# EAGLE design relay node (EAGLE 9.6.2)
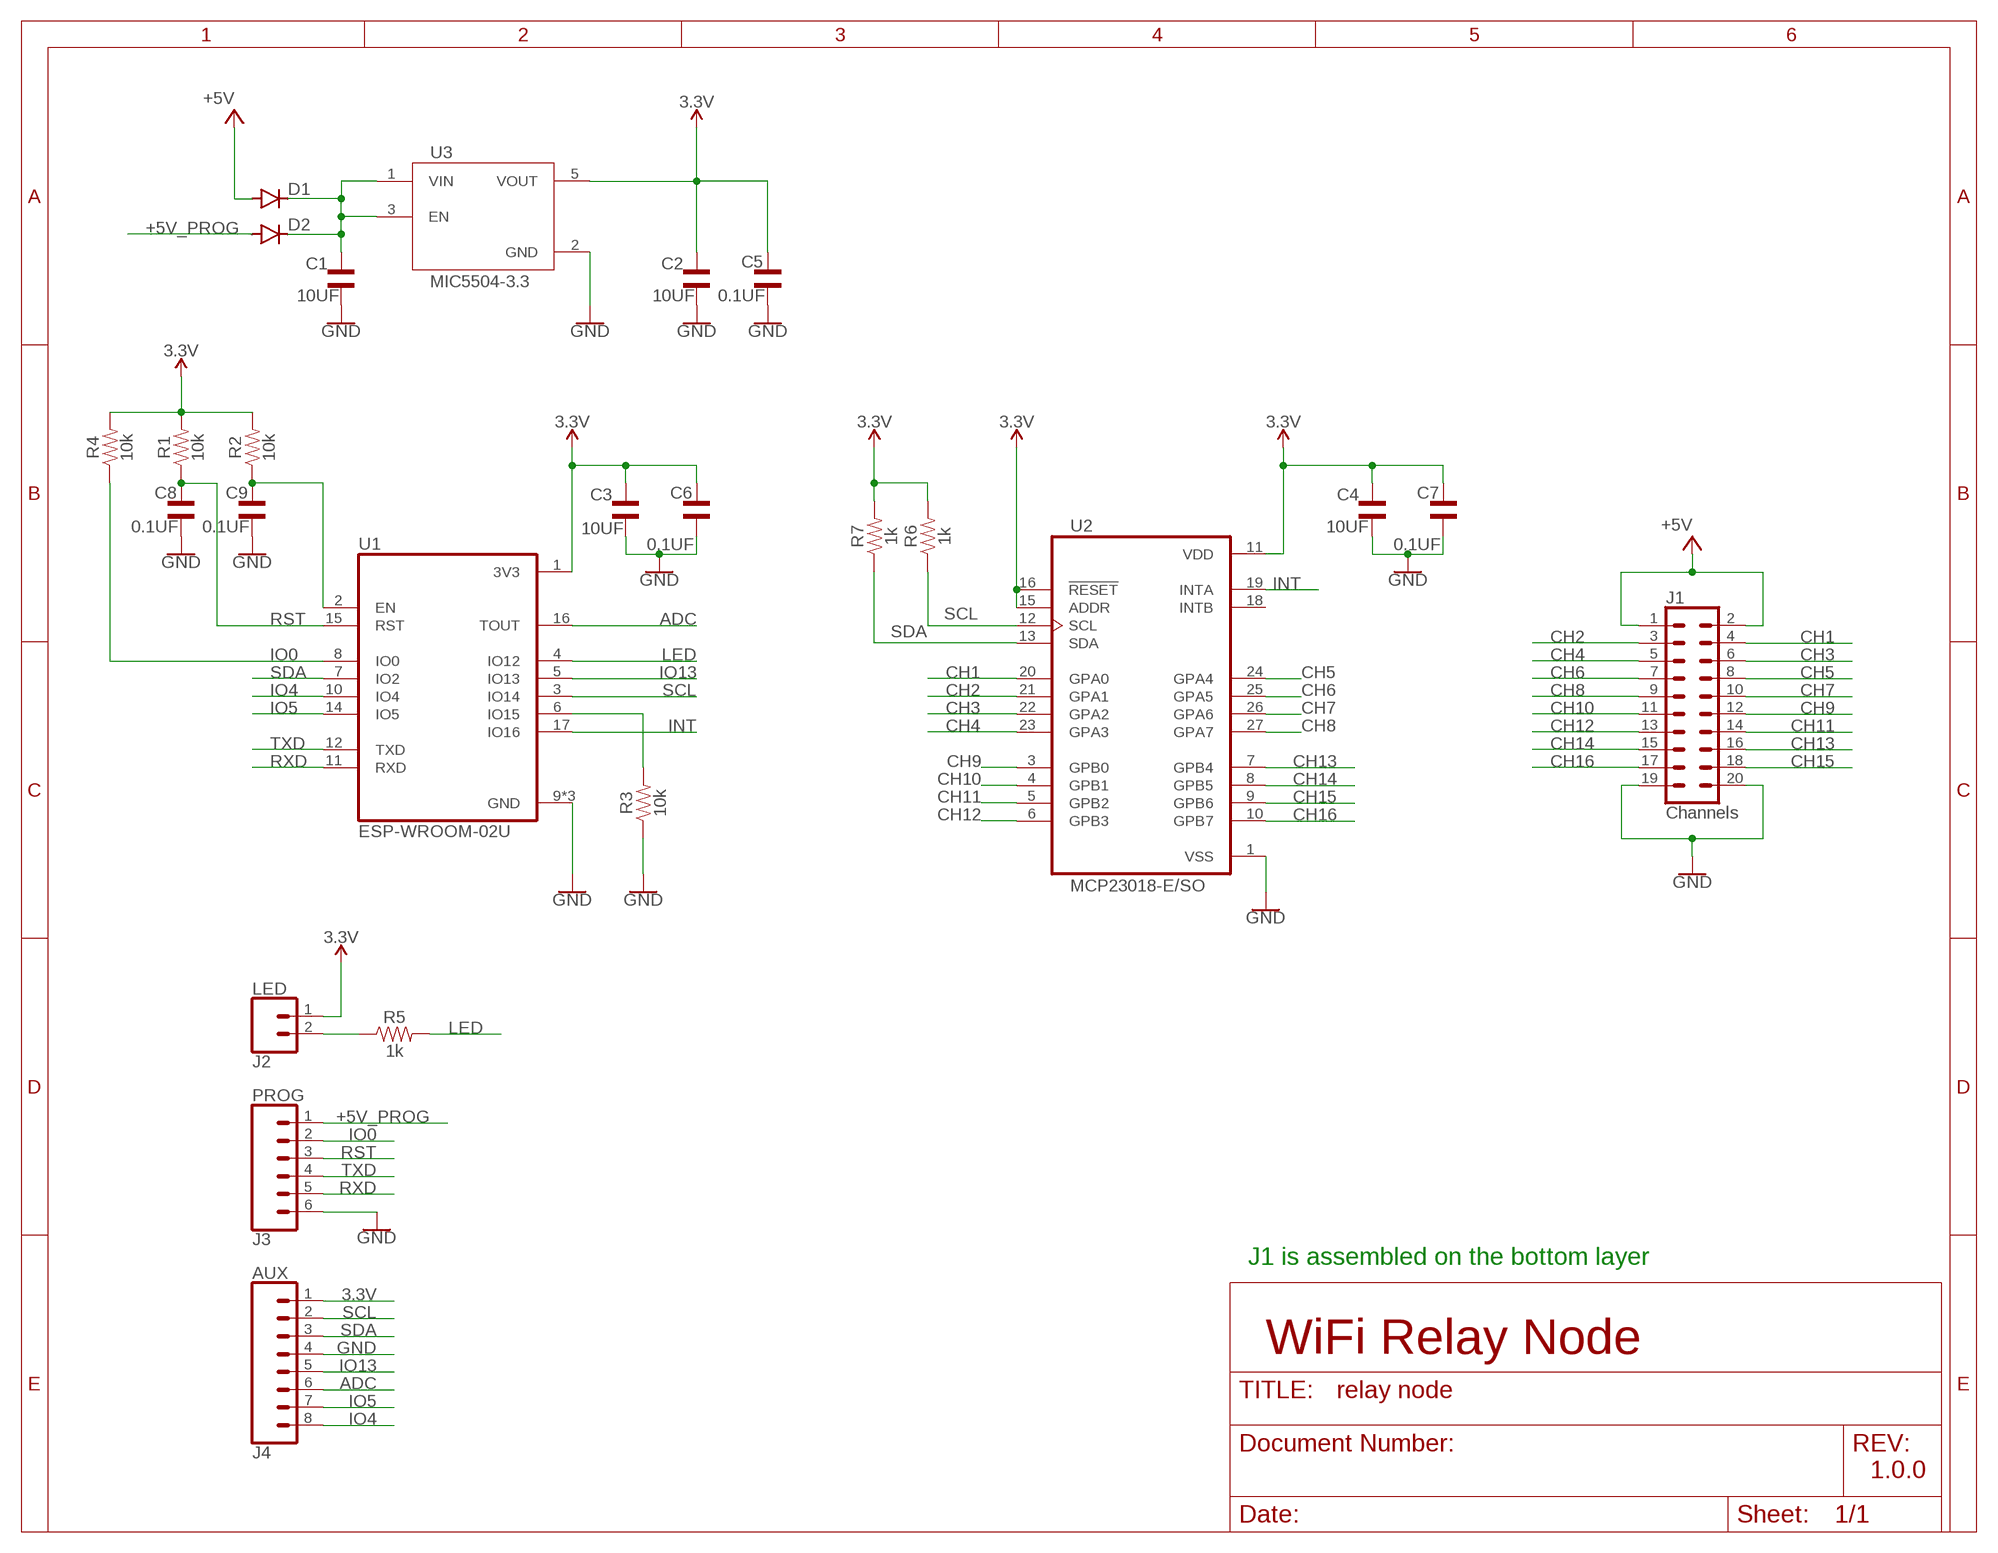
[diagram p0: schematic, sheet 1]

## Parts
C1  10UF  [CAPC2012X135N]
C2  10UF  [CAPC2012X135N]
C3  10UF  [CAPC2012X135N]
C4  10UF  [CAPC2012X135N]
C5  0.1UF  [CAPC1608X90]
C6  0.1UF  [CAPC1608X90]
C7  0.1UF  [CAPC1608X90]
C8  0.1UF  [CAPC1608X90]
C9  0.1UF  [CAPC1608X90]
D1  MBR0520LT  [SOD123]
D2  MBR0520LT  [SOD123]
J1  Channels  CONN_10X2NOSILK  [2X10_NOSILK]
J2  LED  CONN_02  [1X02]
J3  PROG  CONN_06SILK_FEMALE_PTH  [1X06]
J4  AUX  CONN_08"  [1X08]
R1  10k  10KOHM-0603-1/10W-5%  [0603]
R2  10k  10KOHM-0603-1/10W-5%  [0603]
R3  10k  10KOHM-0603-1/10W-5%  [0603]
R4  10k  10KOHM-0603-1/10W-5%  [0603]
R5  1k  1KOHM-0603-1/10W-5%  [0603]
R6  1k  1KOHM-0603-1/10W-5%  [0603]
R7  1k  1KOHM-0603-1/10W-5%  [0603]
U1  ESP-WROOM-02U  [MODULE_ESP-WROOM-02U]
U2  MCP23018-E/SO  [SOIC127P1030X265-28N]
U3  MIC5504-3.3  MIC5504-3.3YM5-T5  [SOT95P280X145-5N]

## Nets
3.3V: C2.1 C3.1 C4.1 C5.1 C6.1 C7.1 J2.1 J4.1 R1.2 R2.2 R4.2 R6.2 R7.2 U1.1(3V3) U2.11(VDD) U2.15(ADDR) U2.16(!RESET) U3.5(VOUT)
+5V: D1.A J1.1 J1.2
+5V_PROG: D2.A J3.1
ADC: J4.6 U1.16(TOUT)
CH1: J1.4 U2.20(GPA0)
CH2: J1.3 U2.21(GPA1)
CH3: J1.6 U2.22(GPA2)
CH4: J1.5 U2.23(GPA3)
CH5: J1.8 U2.24(GPA4)
CH6: J1.7 U2.25(GPA5)
CH7: J1.10 U2.26(GPA6)
CH8: J1.9 U2.27(GPA7)
CH9: J1.12 U2.3(GPB0)
CH10: J1.11 U2.4(GPB1)
CH11: J1.14 U2.5(GPB2)
CH12: J1.13 U2.6(GPB3)
CH13: J1.16 U2.7(GPB4)
CH14: J1.15 U2.8(GPB5)
CH15: J1.18 U2.9(GPB6)
CH16: J1.17 U2.10(GPB7)
GND: C1.2 C2.2 C3.2 C4.2 C5.2 C6.2 C7.2 C8.2 C9.2 J1.19 J1.20 J3.6 J4.4 R3.1 U1.9(GND) U1.13(GND) U1.18(GND) U2.1(VSS) U3.2(GND)
INT: U1.17(IO16) U2.19(INTA)
IO0: J3.2 R4.1 U1.8(IO0)
IO4: J4.8 U1.10(IO4)
IO5: J4.7 U1.14(IO5)
IO13: J4.5 U1.5(IO13)
LED: R5.2 U1.4(IO12)
N$1: C1.1 D1.C D2.C U3.1(VIN) U3.3(EN)
N$2: R3.2 U1.6(IO15)
N$3: C9.1 R2.1 U1.2(EN)
N$6: J2.2 R5.1
RST: C8.1 J3.3 R1.1 U1.15(RST)
RXD: J3.5 U1.11(RXD)
SCL: J4.2 R6.1 U1.3(IO14) U2.12(SCL)
SDA: J4.3 R7.1 U1.7(IO2) U2.13(SDA)
TXD: J3.4 U1.12(TXD)
Unconnected: U2.18(INTB)

## Notes on the sheet
- J1 is assembled on the bottom layer
- WiFi Relay Node
- 1.0.0

## Library data of the parts
C1-C4 = SFM-Project:10UF: CAP 10UF 25VDC Z6S 20% SMD 0805 EMBOSSED TAPE; DESCRIPTION: SMD Capacitor X6S(EIA) with Capacitance: 10uF Tol. 20%. Rated Voltage: 25Vdc; DIGI-KEY_PART_NUMBER: 490-10503-1-ND; DIGIKEY-PURCHASE-URL: https://snapeda.com/shop?store=DigiKey&id=1770901; MF: Murata; MP: GRM21BC81E106ME51L; PACKAGE: 0805 Murata
C5-C9 = SFM-Project:0.1UF: Cap Ceramic 0.1uF 25VDC Y5V -20% to 80% SMD 0603 Paper T/R; DESCRIPTION: 0.1µF -20%, +80% 25V Ceramic Capacitor Y5V (F) 0603 (1608 Metric); DIGI-KEY_PART_NUMBER: 399-1100-1-ND; MF: KEMET; MP: C0603C104Z3VACTU; PACKAGE: 0603 Kemet
D1 D2 = SFM-Project:MBR0520LT: SCHOTTKY BARRIER RECTIFIER Source: http://onsemi.com .. MBR0520LT1-D.pdf
J1 = SFM-Project:CONN_10X2: Multi connection point. Often used as Generic Header-pin footprint for 0.1 inch spaced/style header connections On any of the 0.1 inch spaced packages, you can populate with these: Break Away Headers - Straight <https://www.sparkfun.com/products/116> (PRT-00116) Break Away Male Headers - Right Angle <https://www.sparkfun.com/products/553> (PRT-00553) Female Headers <https://www.sparkfun.com/products/115> (PRT-00115) Break Away Headers - Machine Pin <https://www.sparkfun.com/products/117> (PRT-00117) Break Away Female Headers - Swiss Machine Pin <https://www.sparkfun.com/products/743> (PRT-00743) Special note about the "SPECIAL" package: This was SPECIALLY designed to be used with our Graphic LCD Backpack. Be sure you want to use this! It is not only staggered on each line of header holes, but IT IS ALSO offset of the center point of the top and bottom lines by 5 mil. This causes the headers to lock into place on the "standard" footprint on the LCD screen. The extra squares on the tdocu layer are there simply to reference other pins (if you were to actually populate a longer header than ten long - this is what we do with the backpacks).
J2 = SFM-Project:CONN_02: Multi connection point. Often used as Generic Header-pin footprint for 0.1 inch spaced/style header connections On any of the 0.1 inch spaced packages, you can populate with these: Break Away Headers - Straight <https://www.sparkfun.com/products/116> (PRT-00116) Break Away Male Headers - Right Angle <https://www.sparkfun.com/products/553> (PRT-00553) Female Headers <https://www.sparkfun.com/products/115> (PRT-00115) Break Away Headers - Machine Pin <https://www.sparkfun.com/products/117> (PRT-00117) Break Away Female Headers - Swiss Machine Pin <https://www.sparkfun.com/products/743> (PRT-00743) For SCREWTERMINALS and SPRING TERMINALS visit here: Screw Terimnals on SparkFun.com <https://www.sparkfun.com/search/results?term=Screw+Terminals> (5mm/3.5mm/2.54mm spacing) This device is also useful as a general connection point to wire up your design to another part of your project. Our various solder wires solder well into these plated through hole pads. Hook-Up Wire - Assortment (Stranded, 22 AWG) <https://www.sparkfun.com/products/11375> (PRT-11375) Hook-Up Wire - Assortment (Solid Core, 22 AWG) <https://www.sparkfun.com/products/11367> (PRT-11367) View the entire wire category on our website here <https://www.sparkfun.com/categories/141> Special notes: Molex polarized connector foot print use with: PRT-08233 with associated crimp pins and housings. 2.54_SCREWTERM for use with PRT-10571. 3.5mm Screw Terminal footprints for PRT-08084 5mm Screw Terminal footprints for use with PRT-08432
J3 = SFM-Project:CONN_06: Multi connection point. Often used as Generic Header-pin footprint for 0.1 inch spaced/style header connections On any of the 0.1 inch spaced packages, you can populate with these: Break Away Headers - Straight <https://www.sparkfun.com/products/116> (PRT-00116) Break Away Male Headers - Right Angle <https://www.sparkfun.com/products/553> (PRT-00553) Female Headers <https://www.sparkfun.com/products/115> (PRT-00115) Break Away Headers - Machine Pin <https://www.sparkfun.com/products/117> (PRT-00117) Break Away Female Headers - Swiss Machine Pin <https://www.sparkfun.com/products/743> (PRT-00743) Arduino Stackable Header - 6 Pin <https://www.sparkfun.com/products/9280> (PRT-09280) For SCREWTERMINALS and SPRING TERMINALS visit here: Screw Terimnals on SparkFun.com <https://www.sparkfun.com/search/results?term=Screw+Terminals> (5mm/3.5mm/2.54mm spacing) This device is also useful as a general connection point to wire up your design to another part of your project. Our various solder wires solder well into these plated through hole pads. Hook-Up Wire - Assortment (Stranded, 22 AWG) <https://www.sparkfun.com/products/11375> (PRT-11375) Hook-Up Wire - Assortment (Solid Core, 22 AWG) <https://www.sparkfun.com/products/11367> (PRT-11367) View the entire wire category on our website here <https://www.sparkfun.com/categories/141>; PROD_ID: CONN-08437
J4 = SFM-Project:CONN_08: Multi connection point. Often used as Generic Header-pin footprint for 0.1 inch spaced/style header connections On any of the 0.1 inch spaced packages, you can populate with these: Break Away Headers - Straight <https://www.sparkfun.com/products/116> (PRT-00116) Break Away Male Headers - Right Angle <https://www.sparkfun.com/products/553> (PRT-00553) Female Headers <https://www.sparkfun.com/products/115> (PRT-00115) Break Away Headers - Machine Pin <https://www.sparkfun.com/products/117> (PRT-00117) Break Away Female Headers - Swiss Machine Pin <https://www.sparkfun.com/products/743> (PRT-00743) Arduino Stackable Header - 8 Pin <https://www.sparkfun.com/products/9279> (PRT-09279) For SCREWTERMINALS and SPRING TERMINALS visit here: Screw Terimnals on SparkFun.com <https://www.sparkfun.com/search/results?term=Screw+Terminals> (5mm/3.5mm/2.54mm spacing) This device is also useful as a general connection point to wire up your design to another part of your project. Our various solder wires solder well into these plated through hole pads. Hook-Up Wire - Assortment (Stranded, 22 AWG) <https://www.sparkfun.com/products/11375> (PRT-11375) Hook-Up Wire - Assortment (Solid Core, 22 AWG) <https://www.sparkfun.com/products/11367> (PRT-11367) View the entire wire category on our website here <https://www.sparkfun.com/categories/141> Special notes: Molex polarized connector foot print use with SKU : PRT-08231 with associated crimp pins and housings. 1MM SMD Version SKU: PRT-10208 NOTES ON THE VARIANTS LOCK and LOCK_LONGPADS... This footprint was designed to help hold the alignment of a through-hole component (i.e. 6-pin header) while soldering it into place. You may notice that each hole has been shifted either up or down by 0.005 of an inch from it's more standard position (which is a perfectly straight line). This slight alteration caused the pins (the squares in the middle) to touch the edges of the holes. Because they are alternating, it causes a "brace" to hold the component in place. 0.005 has proven to be the perfect amount of "off-center" position when using our standard breakaway headers. Although looks a little odd when you look at the bare footprint, once you have a header in there, the alteration is very hard to notice. Also,if you push a header all the way into place, it is covered up entirely on the bottom side.; PROD_ID: CONN-08438
R1-R4 = SFM-Project:10KOHM: 10kΩ resistor A resistor is a passive two-terminal electrical component that implements electrical resistance as a circuit element. Resistors act to reduce current flow, and, at the same time, act to lower voltage levels within circuits. - Wikipedia; PROD_ID: RES-09231
R5-R7 = SFM-Project:1KOHM: 1kΩ resistor A resistor is a passive two-terminal electrical component that implements electrical resistance as a circuit element. Resistors act to reduce current flow, and, at the same time, act to lower voltage levels within circuits. - Wikipedia; PROD_ID: RES-09231
U1 = SFM-Project:ESP-WROOM-02U: Module: WiFi; GPIO, I2C, I2S, PWM, SDIO, SPI, UART; U.FL; 2.7÷3.6VDC; AVAILABILITY: Unavailable; DESCRIPTION: WiFi 802.11b/g/n Transceiver Module 2.4GHz ~ 2.5GHz Integrated, Chip + IPEX Surface Mount; MF: Espressif Systems; MP: ESP-WROOM-02U; PACKAGE: SMD-18 Espressif Systems; PRICE: None
U2 = SFM-Project:MCP23018-E/SO: MCP23018 Series 5.5 V 3.4 MHz SMT 16-Bit I2C I/O Expander - SOIC-28; AVAILABILITY: Unavailable; DESCRIPTION: I/O Expander 16 I²C 3.4MHz 28-SOIC; MF: Microchip; MP: MCP23018-E/SO; PACKAGE: SOIC-28 Microchip; PRICE: None
U3 = SFM-Project:MIC5504-3.3YM5-T5: Linear Voltage Regulator IC 1 Output 300mA SOT-23-5; DESCRIPTION: Linear Voltage Regulator IC 1 Output 300mA SOT-23-5; DIGI-KEY_PART_NUMBER: MIC5504-3.3YM5-T5CT-ND; DIGIKEY-PURCHASE-URL: https://snapeda.com/shop?store=DigiKey&id=1219468; MF: Microchip; MP: MIC5504-3.3YM5-T5; PACKAGE: SOT-23-5 Microchip

## Board
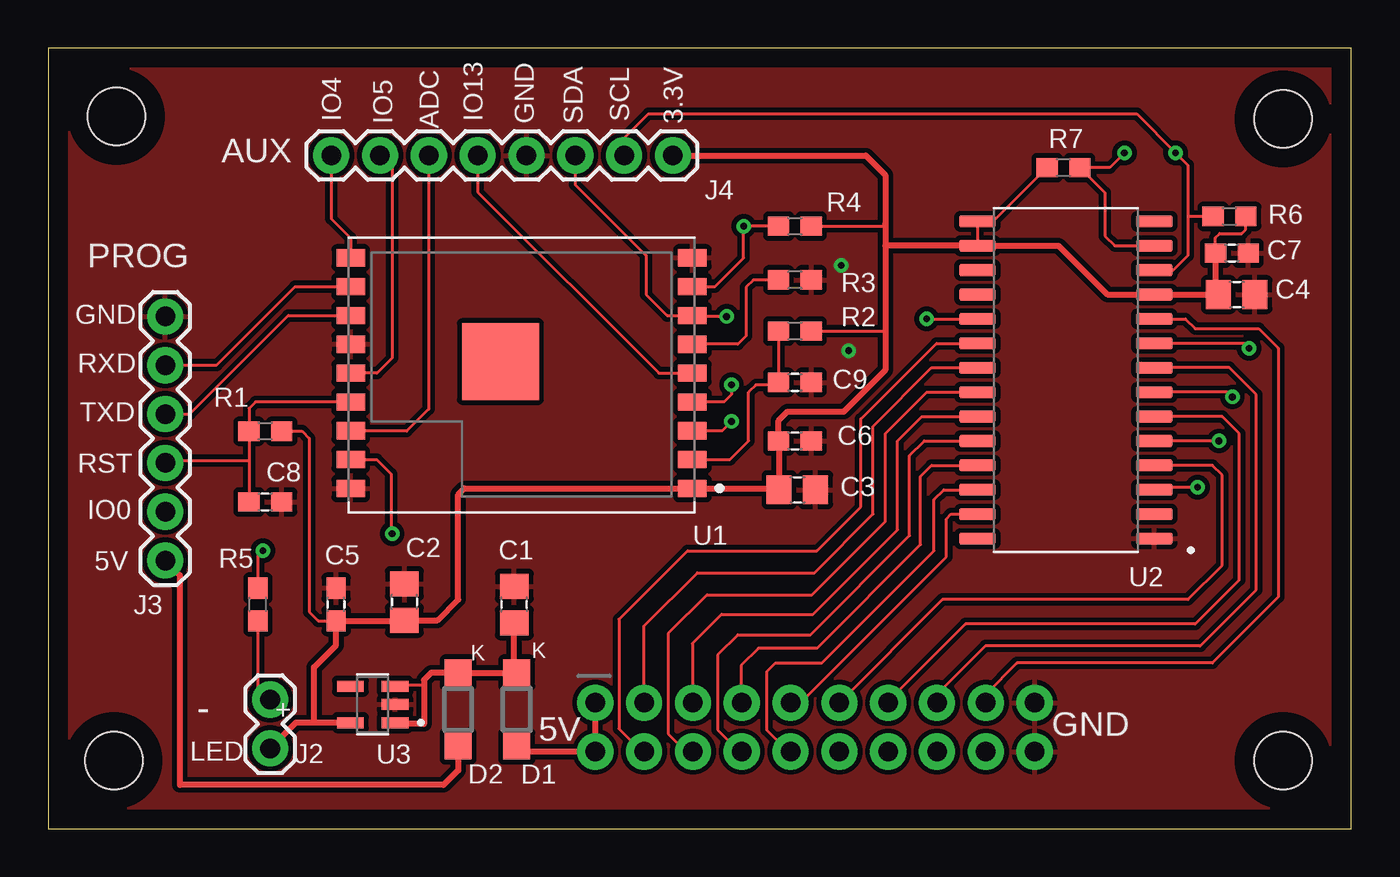
[diagram p1: board, top side]
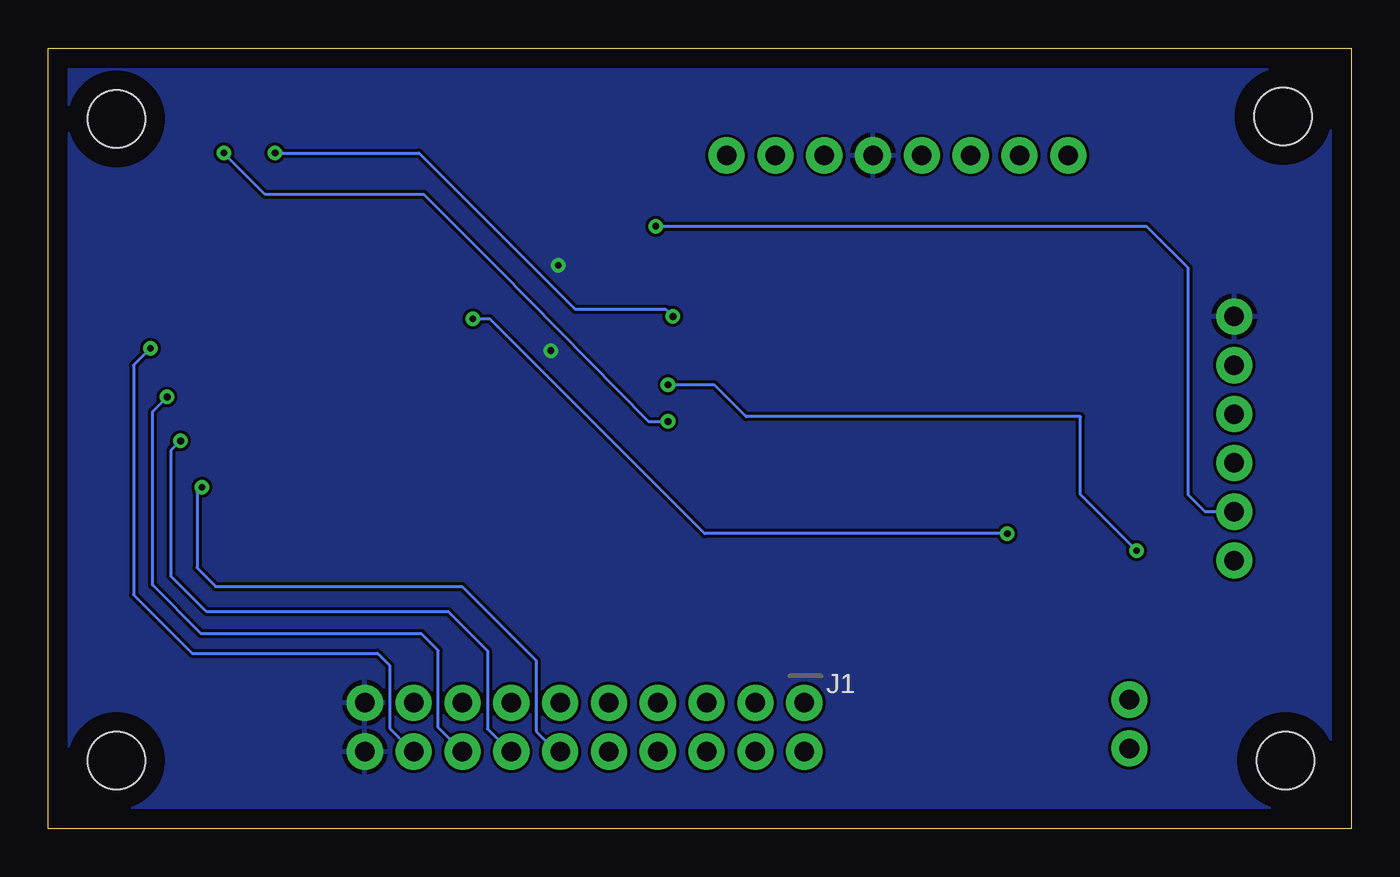
[diagram p2: board, bottom side, seen from below]

Size 67.82 x 40.64 mm. Coordinates in mm from the lower left corner, seen from the top.
Outline: 0,0 67.82,0 67.82,40.64 0,40.63 0,0
Copper layers (1*16): Top 0.035mm / dielectric 1.5mm / Bottom 0.035mm
Design rules "default": minimum track width 6mil, minimum drill 0.35mm, track to track 6mil, track to pad 6mil, pad to pad 6mil, via to via 6mil, smd to smd 6mil, copper to edge 40mil, drill to drill 6mil, minimum pad ring 10mil, minimum via ring 8mil, stop-mask expansion 4mil, vias tented up to drill 0mil, thermal gap 10mil
Holes 3 mm at 3.43,3.56 3.56,37.08 64.26,36.96 64.26,3.56

### Footprints (pad centres in the part's own frame; a part is rotated, then mirrored left to right if it is on the bottom)
CAPC2012X135N = smd 1.3 x 1.5: 1 -0.95,0; 2 0.95,0
CAPC1608X90 = smd 1.1 x 1: 1 -0.85,0; 2 0.85,0
SOD123 = smd 1.4 x 1.4: A 1.9,0; C -1.9,0
2X10_NOSILK = drill 1.016 pad 1.88: 1 0,0; 2 0,2.54; 3 2.54,0; 4 2.54,2.54; 5 5.08,0; 6 5.08,2.54; 7 7.62,0; 8 7.62,2.54; 9 10.16,0; 10 10.16,2.54; 11 12.7,0; 12 12.7,2.54; 13 15.24,0; 14 15.24,2.54; 15 17.78,0; 16 17.78,2.54; 17 20.32,0; 18 20.32,2.54; 19 22.86,0; 20 22.86,2.54
1X02 = drill 1.016 pad 1.88: 1 0,0; 2 2.54,0
1X06 = drill 1.016 pad 1.88: 1 0,0; 2 2.54,0; 3 5.08,0; 4 7.62,0; 5 10.16,0; 6 12.7,0
1X08 = drill 1.016 pad 1.88: 1 0,0; 2 2.54,0; 3 5.08,0; 4 7.62,0; 5 10.16,0; 6 12.7,0; 7 15.24,0; 8 17.78,0
0603 = smd 1.1 x 1: 1 -0.85,0; 2 0.85,0
MODULE_ESP-WROOM-02U = smd 1.485 x 0.9: 1 -8.893,5.9; 2 -8.893,4.4; 3 -8.893,2.9; 4 -8.893,1.4; 5 -8.893,-0.1; 6 -8.893,-1.6; 7 -8.893,-3.1; 8 -8.893,-4.6; 9 -8.893,-6.1; 10 8.893,-6.1; 11 8.893,-4.6; 12 8.893,-3.1; 13 8.893,-1.6; 14 8.893,-0.1; 15 8.893,1.4; 16 8.893,2.9; 17 8.893,4.4; 18 8.893,5.9 | smd 4 x 4: 19 1.1,-0.7
SOIC127P1030X265-28N = smd 1.9 x 0.6: 1 -4.605,8.255; 2 -4.605,6.985; 3 -4.605,5.715; 4 -4.605,4.445; 5 -4.605,3.175; 6 -4.605,1.905; 7 -4.605,0.635; 8 -4.605,-0.635; 9 -4.605,-1.905; 10 -4.605,-3.175; 11 -4.605,-4.445; 12 -4.605,-5.715; 13 -4.605,-6.985; 14 -4.605,-8.255; 15 4.605,-8.255; 16 4.605,-6.985; 17 4.605,-5.715; 18 4.605,-4.445; 19 4.605,-3.175; 20 4.605,-1.905; 21 4.605,-0.635; 22 4.605,0.635; 23 4.605,1.905; 24 4.605,3.175; 25 4.605,4.445; 26 4.605,5.715; 27 4.605,6.985; 28 4.605,8.255
SOT95P280X145-5N = smd 1.39 x 0.58: 1 -1.165,0.95; 2 -1.165,0; 3 -1.165,-0.95; 4 1.165,-0.95; 5 1.165,0.95

### Placement (x,y rotation side)
C1  24.26,11.68 90 top
C2  18.54,11.81 90 top
C3  38.99,17.65 0 top
C4  61.85,27.81 0 top
C5  14.99,11.68 90 top
C6  38.86,20.19 0 top
C7  61.59,29.97 0 top
C8  11.3,17.02 0 top
C9  38.86,23.24 0 top
D1  24.38,6.22 270 top
D2  21.34,6.22 270 top
J1  28.47,6.57 180 bottom
J2  11.56,4.19 90 top
J3  6.1,13.97 90 top
J4  32.51,35.05 180 top
R1  11.3,20.7 0 top
R2  38.86,25.91 0 top
R3  38.86,28.57 180 top
R4  38.86,31.37 0 top
R5  10.92,11.68 90 top
R6  61.47,31.88 0 top
R7  52.83,34.42 180 top
U1  24.64,23.62 180 top
U2  52.96,23.37 180 top
U3  16.89,6.48 180 top

### Tracks (layer width: path | path; a pad name or v marks a point on that pad's centre or on a via)
3.3V
  Top 0.152: R4.2 43.43,31.37 43.56,31.5 | R2.2 43.56,25.91 | R1.2 13.21,20.7 13.59,20.32 13.59,11.3 14.06,10.83 C5.1 | R7.2 49.19,31.62 U2.15 U2.16 | C7.1 60.74,30.77 60.96,30.99 62.1,30.99 62.32,31.2 R6.2
  Top 0.305: J2.1 12.89,5.53 13.84,5.53 | 13.84,5.53 13.84,8.42 14.99,9.56 C5.1 18.52,10.83 C2.1 20.26,10.86 21.34,11.94 21.34,17.4 21.66,17.72 U1.1 37.97,17.72 C3.1 38.04,20.17 C6.1 38.01,21.25 38.48,21.72 41.4,21.72 43.56,23.88 43.56,25.91 43.56,30.35 | J4.1 42.55,35.05 43.56,34.04 43.56,31.5 43.56,30.35 | 43.56,30.35 U2.16 52.58,30.35 55.12,27.81 U2.11 C4.1 60.74,27.97 C7.1 | U3.5 13.84,5.53
+5V
  Top 0.305: J1.1 J1.2 24.68,4.03 D1.A
+5V_PROG
  Top 0.305: D2.A 21.34,3.05 20.57,2.29 6.86,2.29 6.86,13.21 J3.1
ADC
  Top 0.152: J4.6 19.81,21.84 18.67,20.7 15.77,20.7 U1.16
CH1
  Top 0.152: J1.4 30.9,4.03 29.7,5.22 29.7,10.91 33.27,14.48 40.01,14.48 42.29,16.76 42.29,21.34 46.23,25.27 U2.20
CH2
  Top 0.152: J1.3 30.99,6.59 30.99,10.54 33.78,13.34 39.88,13.34 42.93,16.38 42.93,20.95 45.97,24 U2.21
CH3
  Top 0.152: J1.6 33.19,4.03 32.27,4.95 32.27,10.17 34.29,12.19 39.75,12.19 43.56,16 43.56,20.57 45.72,22.73 U2.22
CH4
  Top 0.152: J1.5 33.53,6.59 33.53,9.65 35.05,11.18 39.8,11.18 44.2,15.57 44.2,20.19 45.47,21.46 U2.23
CH5
  Top 0.152: J1.8 35.98,4.03 34.84,5.17 34.84,9.05 35.89,10.11 39.67,10.11 44.83,15.27 44.83,19.43 45.59,20.19 U2.24
CH6
  Top 0.152: J1.7 36.07,6.59 36.07,8.51 36.96,9.4 40.01,9.4 45.4,14.8 45.4,18.35 45.97,18.92 U2.25
CH7
  Top 0.152: J1.10 38.52,4.03 37.39,5.16 37.39,8.18 37.85,8.64 40.26,8.64 46.1,14.48 46.1,17.14 46.61,17.65 U2.26
CH8
  Top 0.152: U2.27 46.99,16.38 46.74,16.13 46.74,14.16 39.14,6.57 J1.9
CH9  (via drill 0.35)
  Top 0.152: U2.3 57.69,17.78 v59.82,17.78
  Bottom 0.152: v59.82,17.78 60.07,17.53 60.07,13.59 59.1,12.62 46.27,12.62 42.42,8.76 42.42,5.08 41.36,4.03 J1.12
CH10
  Top 0.152: J1.11 46.55,11.94 59.31,11.94 61.09,13.72 61.09,18.41 60.58,18.92 U2.4
CH11  (via drill 0.35)
  Top 0.152: v60.92,20.19 U2.5
  Bottom 0.152: v60.92,20.19 61.43,19.68 61.43,13.17 59.56,11.3 46.99,11.3 44.96,9.27 44.96,5.21 43.78,4.03 J1.14
CH12
  Top 0.152: J1.13 43.71,6.64 47.74,10.67 59.69,10.67 61.98,12.95 61.98,20.57 61.09,21.46 U2.6
CH13  (via drill 0.35)
  Top 0.152: U2.7 57.61,22.78 57.66,22.73 61.37,22.73 v61.62,22.48
  Bottom 0.152: v61.62,22.48 62.38,21.72 62.38,12.69 59.85,10.16 48.39,10.16 47.51,9.28 47.51,5.28 J1.16
CH14
  Top 0.152: J1.15 46.25,7.01 48.77,9.53 59.94,9.53 62.87,12.45 62.87,22.61 61.47,24 U2.8
CH15  (via drill 0.35)
  Top 0.152: v62.48,25.02 62.23,25.27 U2.9
  Bottom 0.152: v62.48,25.02 63.37,24.13 63.37,12.19 60.33,9.14 50.67,9.14 50.04,8.51 50.04,5.25 48.82,4.03 J1.18
CH16
  Top 0.152: J1.17 48.79,7.01 50.42,8.64 60.58,8.64 64.01,12.06 64.01,25.02 62.99,26.04 59.69,26.04 59.18,26.54 U2.10
GND  (via drill 0.35)
  other vias: 41.27,29.34 41.66,24.89
  pour Top (isolate 0.254): 0.13,0.13 0.13,40.51 67.69,40.51 67.69,0.13
  pour Bottom: 0.13,40.51 0.13,0.13 67.69,0.13 67.56,40.51
  pour Bottom (no thermals): 4.83,11.18 4.83,6.22 24.64,6.22 24.64,11.18
INT  (via drill 0.35)
  Top 0.152: U1.17 17.1,19.22 17.84,18.48 17.84,15.43 v17.91,15.37 | v45.72,26.54 U2.19
  Bottom 0.152: v17.91,15.37 33.66,15.37 44.83,26.54 v45.72,26.54
IO0  (via drill 0.35)
  Top 0.152: R4.1 v36.2,31.37 36.2,29.72 34.7,28.22 U1.8
  Bottom 0.152: v36.2,31.37 10.67,31.37 8.51,29.21 8.51,17.4 7.62,16.51 J3.2
IO4
  Top 0.152: J4.8 14.73,31.75 15.74,30.74 U1.10
IO5
  Top 0.152: J4.7 17.91,34.42 17.91,24.51 17.12,23.72 U1.14
IO13
  Top 0.152: J4.5 22.35,33.15 31.78,23.72 U1.5
LED  (via drill 0.35)
  Top 0.152: v35.56,23.11 35.56,22.61 35.18,22.22 U1.4 | R5.2 10.92,14.22 v11.18,14.48
  Bottom 0.152: v11.18,14.48 14.1,17.4 14.1,21.46 31.5,21.46 33.15,23.11 v35.56,23.11
N$1
  Top 0.152: U3.3 18.12,7.49 19.56,7.49
  Top 0.305: D2.C | D2.C 19.93,8.12 19.56,7.75 19.56,7.49 19.56,5.46 18.12,5.46 U3.1 | D2.C D1.C 24.26,8.25 C1.1
N$2
  Top 0.152: R3.2 36.7,28.57 36.32,28.19 36.32,25.65 35.89,25.22 U1.6
N$3
  Top 0.152: R2.1 C9.1 37.88,23.11 36.83,23.11 36.45,22.73 36.45,20.19 35.48,19.22 U1.2
N$6
  Top 0.152: J2.2 10.92,6.73 R5.1
RST
  Top 0.152: U1.15 10.8,22.22 10.79,22.23 10.45,21.88 R1.1 10.45,19.18 | 10.45,19.18 C8.1 | J3.3 6.22,19.18 10.45,19.18
RXD
  Top 0.152: J3.5 8.76,24.13 12.86,28.22 U1.11
SCL  (via drill 0.35)
  Top 0.152: v35.56,21.21 35.07,20.72 U1.3 | J4.2 29.97,35.94 31.24,37.21 56.64,37.21 v58.67,35.18 59.31,34.54 59.31,31.88 | U2.12 58.55,29.08 59.31,29.84 59.31,31.88 | R6.1 59.31,31.88
  Bottom 0.152: v35.56,21.21 36.58,21.21 44.32,29.08 48.26,33.02 56.52,33.02 v58.67,35.18
SDA  (via drill 0.35)
  Top 0.152: v35.31,26.67 33.58,26.67 U1.7 32.21,26.72 31.11,27.81 31.11,29.84 27.43,33.53 J4.3 | U2.13 55.5,30.35 54.99,30.86 54.99,33.11 R7.1 55.24,34.42 v56.01,35.18
  Bottom 0.152: v56.01,35.18 48.51,35.18 40.39,27.05 35.69,27.05 v35.31,26.67
TXD
  Top 0.152: J3.4 7.37,21.59 12.5,26.72 U1.12

### Text on the board
tNames: IO4 | IO5 | IO13 | GND | SDA | SCL | 3.3V | ADC | AUX | PROG | GND | RXD | TXD | RST | IO0 | 5V | K | K | - | + | GND | 5V | LED
bRestrict: RELAY NODE / v1.0.0